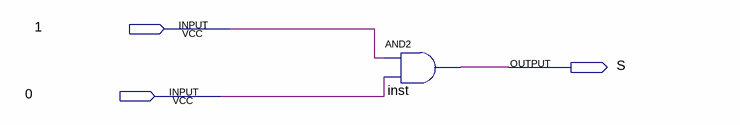
[diagram p0: schematic sheet]
// Quartus schematic Aula0.bdf as structural Verilog: 1 symbols, 3 pins
module Aula0 (
  input  \1 ,
  input  \0 ,
  output S
);

  and inst (S, \1 , \0 );
endmodule
